# Altium project FIT_High_Current_Backplane.PrjPCB
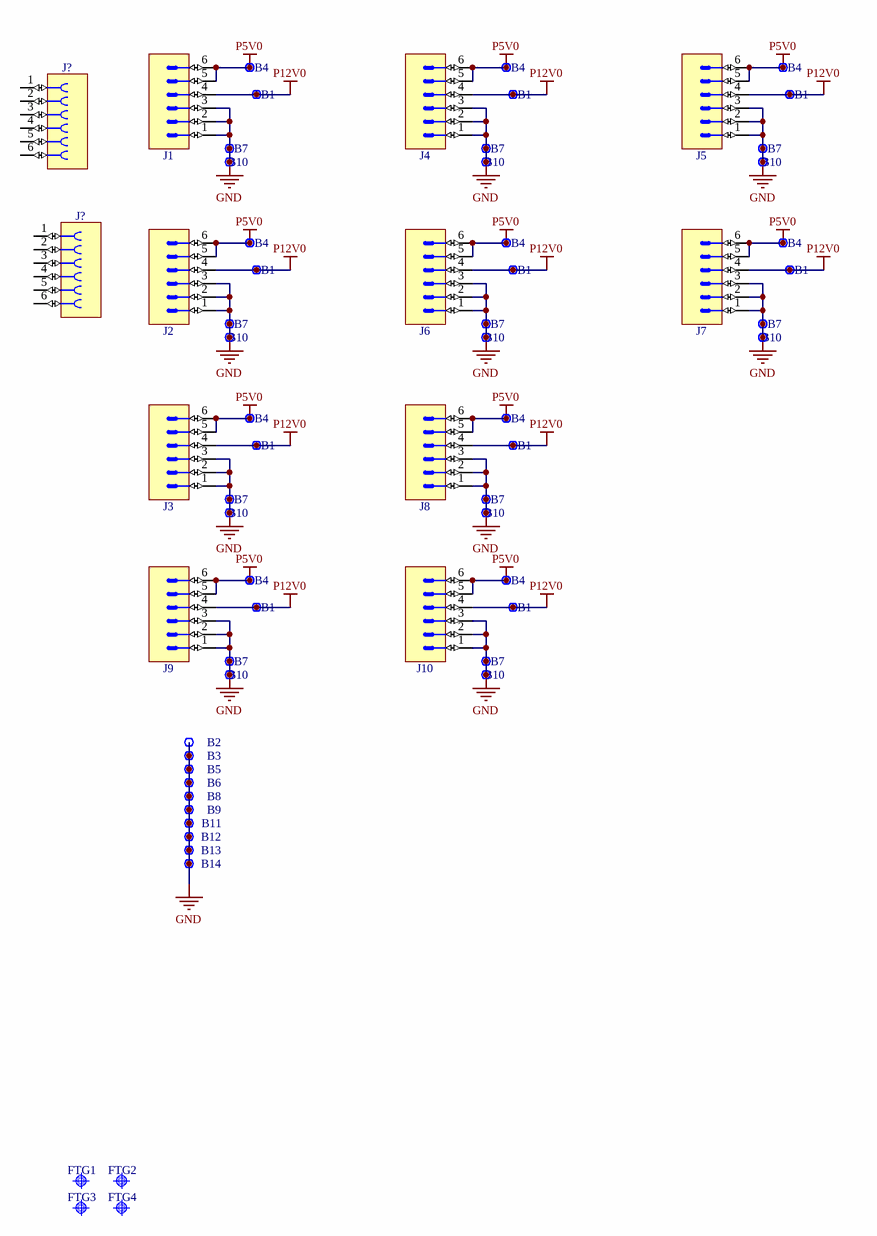
[diagram p0: FIT_High_Current_Backplane.SchDoc]
1 sheet, 66 parts. Net scope: global (net labels, ports and power ports of the same name join across sheets).
Board file: FIT_High_Current_Backplane.pcbdoc

## Sheet FIT_High_Current_Backplane.SchDoc
size 420 x 297 mm

### Parts
(Parts that share a designator on the sheet are numbered #1, #2 ... from top to bottom, then left to right.)
B1#1  Plated Hole  [MTG270_500]  (value not drawn)  (no BOM)
B1#2  Plated Hole  [MTG270_500]  (value not drawn)  (no BOM)
B1#3  Plated Hole  [MTG270_500]  (value not drawn)  (no BOM)
B1#4  Plated Hole  [MTG270_500]  (value not drawn)  (no BOM)
B1#5  Plated Hole  [MTG270_500]  (value not drawn)  (no BOM)
B1#6  Plated Hole  [MTG270_500]  (value not drawn)  (no BOM)
B1#7  Plated Hole  [MTG270_500]  (value not drawn)  (no BOM)
B1#8  Plated Hole  [MTG270_500]  (value not drawn)  (no BOM)
B1#9  Plated Hole  [MTG270_500]  (value not drawn)  (no BOM)
B1#10  Plated Hole  [MTG270_500]  (value not drawn)  (no BOM)
B2  Plated Hole  [MTG270_500]  (value not drawn)  (no BOM)
B3  Plated Hole  [MTG270_500]  (value not drawn)  (no BOM)
B4#1  Plated Hole  [MTG270_500]  (value not drawn)  (no BOM)
B4#2  Plated Hole  [MTG270_500]  (value not drawn)  (no BOM)
B4#3  Plated Hole  [MTG270_500]  (value not drawn)  (no BOM)
B4#4  Plated Hole  [MTG270_500]  (value not drawn)  (no BOM)
B4#5  Plated Hole  [MTG270_500]  (value not drawn)  (no BOM)
B4#6  Plated Hole  [MTG270_500]  (value not drawn)  (no BOM)
B4#7  Plated Hole  [MTG270_500]  (value not drawn)  (no BOM)
B4#8  Plated Hole  [MTG270_500]  (value not drawn)  (no BOM)
B4#9  Plated Hole  [MTG270_500]  (value not drawn)  (no BOM)
B4#10  Plated Hole  [MTG270_500]  (value not drawn)  (no BOM)
B5  Plated Hole  [MTG270_500]  (value not drawn)  (no BOM)
B6  Plated Hole  [MTG270_500]  (value not drawn)  (no BOM)
B7#1  Plated Hole  [MTG270_500]  (value not drawn)  (no BOM)
B7#2  Plated Hole  [MTG270_500]  (value not drawn)  (no BOM)
B7#3  Plated Hole  [MTG270_500]  (value not drawn)  (no BOM)
B7#4  Plated Hole  [MTG270_500]  (value not drawn)  (no BOM)
B7#5  Plated Hole  [MTG270_500]  (value not drawn)  (no BOM)
B7#6  Plated Hole  [MTG270_500]  (value not drawn)  (no BOM)
B7#7  Plated Hole  [MTG270_500]  (value not drawn)  (no BOM)
B7#8  Plated Hole  [MTG270_500]  (value not drawn)  (no BOM)
B7#9  Plated Hole  [MTG270_500]  (value not drawn)  (no BOM)
B7#10  Plated Hole  [MTG270_500]  (value not drawn)  (no BOM)
B8  Plated Hole  [MTG270_500]  (value not drawn)  (no BOM)
B9  Plated Hole  [MTG270_500]  (value not drawn)  (no BOM)
B10#1  Plated Hole  [MTG270_500]  (value not drawn)  (no BOM)
B10#2  Plated Hole  [MTG270_500]  (value not drawn)  (no BOM)
B10#3  Plated Hole  [MTG270_500]  (value not drawn)  (no BOM)
B10#4  Plated Hole  [MTG270_500]  (value not drawn)  (no BOM)
B10#5  Plated Hole  [MTG270_500]  (value not drawn)  (no BOM)
B10#6  Plated Hole  [MTG270_500]  (value not drawn)  (no BOM)
B10#7  Plated Hole  [MTG270_500]  (value not drawn)  (no BOM)
B10#8  Plated Hole  [MTG270_500]  (value not drawn)  (no BOM)
B10#9  Plated Hole  [MTG270_500]  (value not drawn)  (no BOM)
B10#10  Plated Hole  [MTG270_500]  (value not drawn)  (no BOM)
B11  Plated Hole  [MTG270_500]  (value not drawn)  (no BOM)
B12  Plated Hole  [MTG270_500]  (value not drawn)  (no BOM)
B13  Plated Hole  [MTG270_500]  (value not drawn)  (no BOM)
B14  Plated Hole  [MTG270_500]  (value not drawn)  (no BOM)
FTG1  Use only in PCB  [FIDUCIAL_TOP_C100-200]  (value not drawn)
FTG2  Use only in PCB  [FIDUCIAL_TOP_S100-200]  (value not drawn)
FTG3  Use only in PCB  [FIDUCIAL_TOP_C100-200]  (value not drawn)
FTG4  Use only in PCB  [FIDUCIAL_TOP_S100-200]  (value not drawn)
J1  Mini-Fit Jr.™  [MOLEX_46010-0611]  (value not drawn)
J2  Mini-Fit Jr.™  [MOLEX_46010-0611]  (value not drawn)
J3  Mini-Fit Jr.™  [MOLEX_46010-0611]  (value not drawn)
J4  Mini-Fit Jr.™  [MOLEX_46010-0611]  (value not drawn)
J5  Mini-Fit Jr.™  [MOLEX_46010-0611]  (value not drawn)
J6  Mini-Fit Jr.™  [MOLEX_46010-0611]  (value not drawn)
J7  Mini-Fit Jr.™  [MOLEX_46010-0611]  (value not drawn)
J8  Mini-Fit Jr.™  [MOLEX_46010-0611]  (value not drawn)
J9  Mini-Fit Jr.™  [MOLEX_46010-0611]  (value not drawn)
J10  Mini-Fit Jr.™  [MOLEX_46010-0611]  (value not drawn)
J?#1  Mini-Fit  [MOLEX_460100611]  (value not drawn)
J?#2  Mini-Fit  [MOLEX_460100611]  (value not drawn)

### Nets
GND: B2.1 B3.1 B5.1 B6.1 B7#1.1 B7#2.1 B7#3.1 B7#4.1 B7#5.1 B7#6.1 B7#7.1 B7#8.1 B7#9.1 B7#10.1 B8.1 B9.1 B10#1.1 B10#2.1 B10#3.1 B10#4.1 B10#5.1 B10#6.1 B10#7.1 B10#8.1 B10#9.1 B10#10.1 B11.1 B12.1 B13.1 B14.1 J1.1 J1.2 J1.3 J2.1 J2.2 J2.3 J3.1 J3.2 J3.3 J4.1 J4.2 J4.3 J5.1 J5.2 J5.3 J6.1 J6.2 J6.3 J7.1 J7.2 J7.3 J8.1 J8.2 J8.3 J9.1 J9.2 J9.3 J10.1 J10.2 J10.3
P5V0: B4#1.1 B4#2.1 B4#3.1 B4#4.1 B4#5.1 B4#6.1 B4#7.1 B4#8.1 B4#9.1 B4#10.1 J1.5 J1.6 J2.5 J2.6 J3.5 J3.6 J4.5 J4.6 J5.5 J5.6 J6.5 J6.6 J7.5 J7.6 J8.5 J8.6 J9.5 J9.6 J10.5 J10.6
P12V0: B1#1.1 B1#2.1 B1#3.1 B1#4.1 B1#5.1 B1#6.1 B1#7.1 B1#8.1 B1#9.1 B1#10.1 J1.4 J2.4 J3.4 J4.4 J5.4 J6.4 J7.4 J8.4 J9.4 J10.4

Not connected (* = marked no-connect by the designer): J?#1 1 2 3 4 5 6; J?#2 1 2 3 4 5 6

### Notes on the sheet
- Project/Equipment
- Document
- Designer
- Drawn by
- Check.by
- Copyright WUT ISE 2019.
  This documentation describes Open Hardware and is licensed under the CERN OHL v.1.1. You may redistribute and modify this documentation under the terms of the CERN OHL v.1.1. (http://ohwr.org/CERNOHL). This documentation is distributed WITHOUT ANY EXPRESS OR IMPLIED WARRANTY, INCLUDING OF MERCHANTABILITY, SATISFACTORY QUALITY AND FITNESS FOR A PARTICULAR PURPOSE. Please see the CERN OHL v.1.1 for applicable conditions.
- Contact
- File
- Last Mod.
- Print Date
- Sheet
- Size
- A3
- of
- Rev

### Library data of the parts
B1#1-B1#10 B2 B3 B4#1-B4#10 B5 B6 B7#1-B7#10 B8 B9 B10#1-B10#10 B11-B14 = PLATED_HOLE2.7_PAD5.0: Single Terminal Socket; Part Description: Plated Through Hole: Hole Dia.=2.7mm Pad Dia.=5.0mm; Mounted: No; Part Number: PLATED_HOLE2.7_PAD5.0; Component Type: Standard (No BOM); Pin Count: 1; Family: Plated Hole; Socket: No; SMD: No; Sense: No; Status: None; ComponentHeight: 0mm; HelpURL: Undefined; Author: CERN DEM JMW; CreateDate: 27.09.2011; LatestRevisionDate: 27.09.2011; PackageDescription: Plated Through Hole: Hole Dia.=2.7mm Pad Dia.=5.0mm
FTG1 FTG3 = FIDUCIAL_TARGET_C100-200: Fiducial Target; Part Description: Round Fiducial Target, Top Layer, 1.0mm, Top Solder 2.0mm, Keepout =2.0mm; Mounted: No; Part Number: FIDUCIAL_TARGET_C100-200; Component Kind: Standard (No BOM); Component Type: Standard (No BOM); Pin Count: 1; Family: Fiducial; Socket: No; SMD: Yes; Sense: No; Status: None; ComponentHeight: 0mm; HelpURL: Undefined; Author: CERN DEM JLC; CreateDate: 09.02.2010; LatestRevisionDate: 04.04.2012; PackageDescription: Round Fiducial Target, Top Layer, 1.0mm, Top Solder 2.0mm, Keepout =2.0mm
FTG2 FTG4 = FIDUCIAL_TARGET_S100-200: Fiducial Target; Part Description: Square Fiducial Target, Top Layer, 1.0mm, Top Solder 2.0mm, Keepout =2.0mm; Mounted: No; Part Number: FIDUCIAL_TARGET_S100-200; Component Kind: Standard (No BOM); Component Type: Standard (No BOM); Pin Count: 1; Family: Fiducial; Socket: No; SMD: Yes; Sense: No; Status: None; ComponentHeight: 0mm; HelpURL: Undefined; Author: CERN DEM JLC; CreateDate: 09.02.2010; LatestRevisionDate: 04.04.2012; PackageDescription: Square Fiducial Target, Top Layer, 1.0mm, Top Solder 2.0mm, Keepout =2.0mm
J1-J10 = MOLEX_46010-0611: 4.20mm (.165") Pitch Mini-Fit Jr.™ Plug, Dual Row, Vertical, without Snap-in Plastic Peg PCB Lock, 4 Circuits; Manufacturer: MOLEX; PressFit: No; Part Number: MOLEX_46010-0611; Component Kind: Standard; Component Type: Standard; Pin Count: 6; Family: Mini-Fit Jr.™; Mounted: Yes; Socket: No; SMD: No; Sense: No; Status: None; Part Description: 4.20mm (.165") Pitch Mini-Fit Jr.™ Plug, Dual Row, Vertical, without Snap-in Plastic Peg PCB Lock, 4 Circuits; Manufacturer Part Number: 46010-0611; ComponentHeight: 13.1mm; HelpURL: \\cern.ch\dfs\Applications\Altium\Datasheets\MOLEX_39-28-1043.pdf; Author: GK; CreateDate: 12.03.2009; LatestRevisionDate: 06.03.2012
J?#1 J?#2 = MOLEX_460100611: Connector 6 Female; Part Description: 4.2mm Pitch, Mini-Fit , Dual Row, Vertical, with PCB Pegs, 6 Circuits; Manufacturer: MOLEX; PressFit: No; Part Number: MOLEX_460100611; Component Kind: Standard; Component Type: Standard; Pin Count: 6; Family: Mini-Fit; Mounted: Yes; Socket: No; SMD: No; Sense: No; Status: None; Manufacturer Part Number: 460100611; ComponentHeight: 11.33mm; HelpURL: \\cern.ch\dfs\Applications\Altium\Datasheets\MOLEX_46010.pdf; Author: CERN DEM HF; CreateDate: 12.08.2024; LatestRevisionDate: 12.08.2024